# Altium schematic sheet Analog_Frontend_OpAmp.SchDoc
size A4; CompanyName: Technische Hochschule Nürnberg Georg Simon Ohm; Organization: UltraZohm; Address1: Kesslerplatz 12; Address2: 90489 Nürnberg; Address3: GERMANY; DocumentNumber: 5; SheetNumber: 5; SheetTotal: 12; Website: www.ultrazohm.com
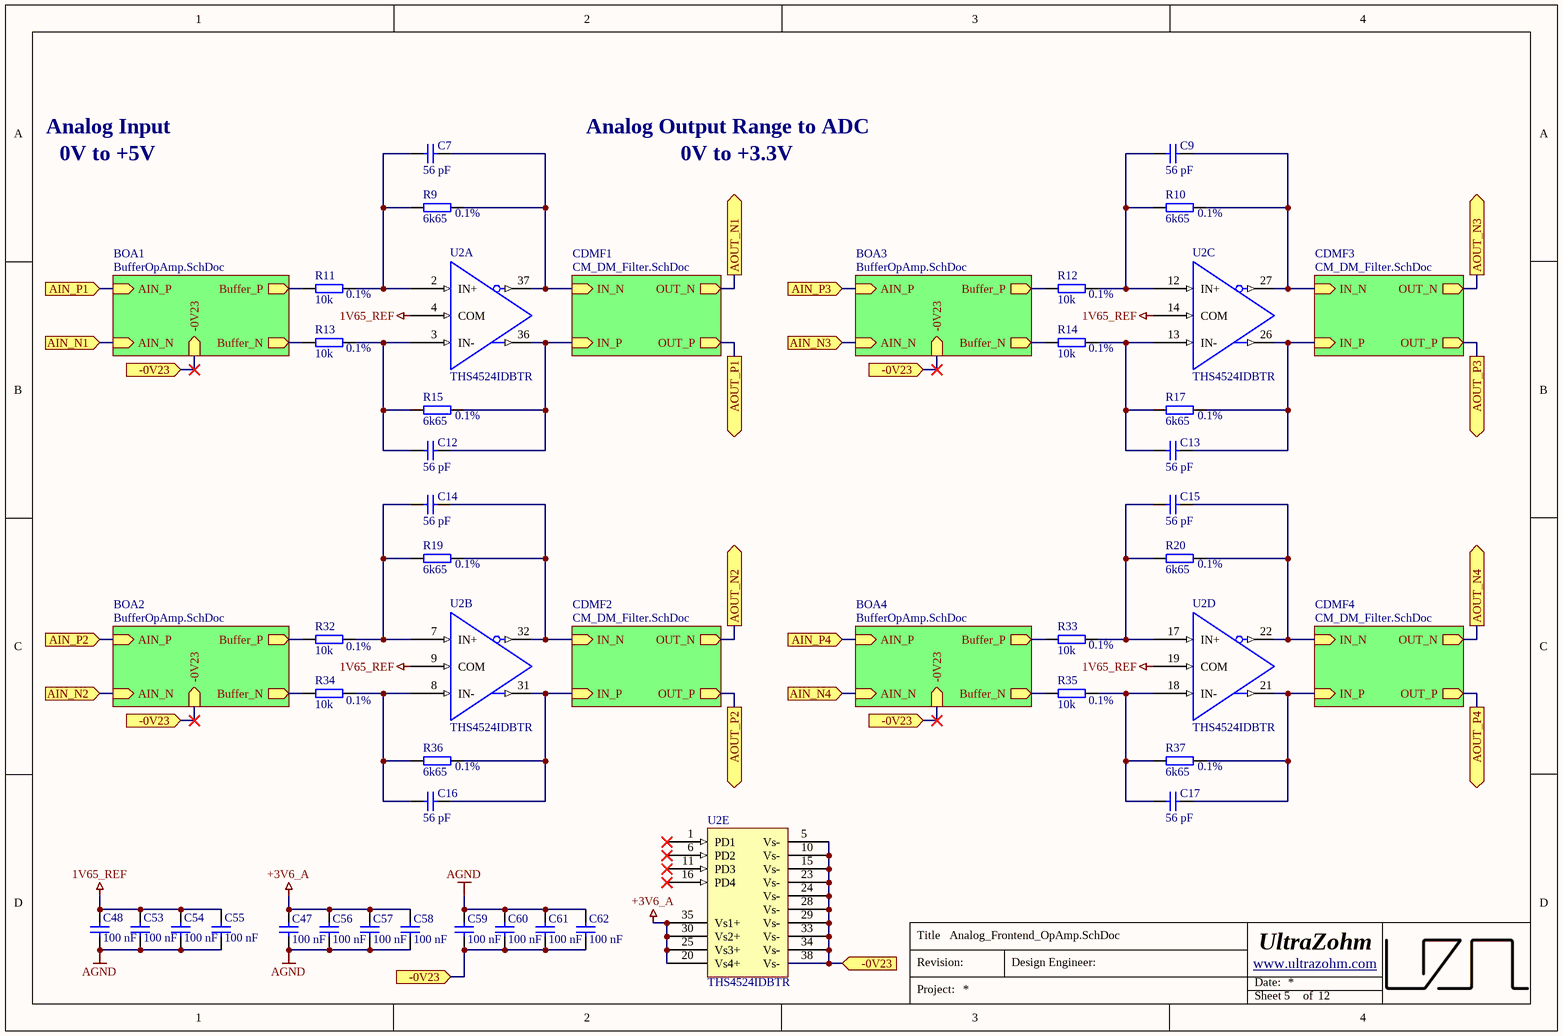
[diagram p0: Analog_Frontend_OpAmp.SchDoc]

## Parts
C7  56 pF  [C_0402_TE]
C9  56 pF  [C_0402_TE]
C12  56 pF  [C_0402_TE]
C13  56 pF  [C_0402_TE]
C14  56 pF  [C_0402_TE]
C15  56 pF  [C_0402_TE]
C16  56 pF  [C_0402_TE]
C17  56 pF  [C_0402_TE]
C47  100 nF  [C_0402_TE]
C48  100 nF  [C_0402_TE]
C53  100 nF  [C_0402_TE]
C54  100 nF  [C_0402_TE]
C55  100 nF  [C_0402_TE]
C56  100 nF  [C_0402_TE]
C57  100 nF  [C_0402_TE]
C58  100 nF  [C_0402_TE]
C59  100 nF  [C_0402_TE]
C60  100 nF  [C_0402_TE]
C61  100 nF  [C_0402_TE]
C62  100 nF  [C_0402_TE]
R9  6k65  Tolerance: 0.1%  [R_0402_TE]
R10  6k65  Tolerance: 0.1%  [R_0402_TE]
R11  10k  Tolerance: 0.1%  [R_0402_TE]
R12  10k  Tolerance: 0.1%  [R_0402_TE]
R13  10k  Tolerance: 0.1%  [R_0402_TE]
R14  10k  Tolerance: 0.1%  [R_0402_TE]
R15  6k65  Tolerance: 0.1%  [R_0402_TE]
R17  6k65  Tolerance: 0.1%  [R_0402_TE]
R19  6k65  Tolerance: 0.1%  [R_0402_TE]
R20  6k65  Tolerance: 0.1%  [R_0402_TE]
R32  10k  Tolerance: 0.1%  [R_0402_TE]
R33  10k  Tolerance: 0.1%  [R_0402_TE]
R34  10k  Tolerance: 0.1%  [R_0402_TE]
R35  10k  Tolerance: 0.1%  [R_0402_TE]
R36  6k65  Tolerance: 0.1%  [R_0402_TE]
R37  6k65  Tolerance: 0.1%  [R_0402_TE]
U2  THS4524IDBTR  [TSSOP-38]  (parts A,B,C,D,E of 5)

## Sub-sheets
BOA1 = BufferOpAmp.SchDoc: Buffer_P (out), Buffer_N (out), AIN_P (in), AIN_N (in), -0V23 (in)
BOA2 = BufferOpAmp.SchDoc: Buffer_P (out), Buffer_N (out), AIN_P (in), AIN_N (in), -0V23 (in)
BOA3 = BufferOpAmp.SchDoc: Buffer_P (out), Buffer_N (out), AIN_P (in), AIN_N (in), -0V23 (in)
BOA4 = BufferOpAmp.SchDoc: Buffer_P (out), Buffer_N (out), AIN_P (in), AIN_N (in), -0V23 (in)
CDMF1 = CM_DM_Filter.SchDoc: IN_P (in), IN_N (in), OUT_P (out), OUT_N (out)
CDMF2 = CM_DM_Filter.SchDoc: IN_P (in), IN_N (in), OUT_P (out), OUT_N (out)
CDMF3 = CM_DM_Filter.SchDoc: IN_P (in), IN_N (in), OUT_P (out), OUT_N (out)
CDMF4 = CM_DM_Filter.SchDoc: IN_P (in), IN_N (in), OUT_P (out), OUT_N (out)

## Ports
-0V23 (in), AIN_N1 (in), AIN_N2 (in), AIN_N3 (in), AIN_N4 (in), AIN_P1 (in), AIN_P2 (in), AIN_P3 (in), AIN_P4 (in), AOUT_N1 (out), AOUT_N2 (out), AOUT_N3 (out), AOUT_N4 (out), AOUT_P1 (out), AOUT_P2 (out), AOUT_P3 (out), AOUT_P4 (out)

## Nets
1V65_REF: C48.1 C53.1 C54.1 C55.1 U2.4(COM) U2.9(COM) U2.14(COM) U2.19(COM)
+3V6_A: C47.1 C56.1 C57.1 C58.1 U2.20(Vs4+) U2.25(Vs3+) U2.30(Vs2+) U2.35(Vs1+)
AGND: C47.2 C48.2 C53.2 C54.2 C55.2 C56.2 C57.2 C58.2 C59.1 C60.1 C61.1 C62.1
-0V23: C59.2 C60.2 C61.2 C62.2 U2.5(Vs-) U2.10(Vs-) U2.15(Vs-) U2.23(Vs-) U2.24(Vs-) U2.28(Vs-) U2.29(Vs-) U2.33(Vs-) U2.34(Vs-) U2.38(Vs-) ; port -0V23, sheet BOA1/-0V23, sheet BOA2/-0V23, sheet BOA3/-0V23, sheet BOA4/-0V23
AIN_N1: port AIN_N1, sheet BOA1/AIN_N
AIN_N2: port AIN_N2, sheet BOA2/AIN_N
AIN_N3: port AIN_N3, sheet BOA3/AIN_N
AIN_N4: port AIN_N4, sheet BOA4/AIN_N
AIN_P1: port AIN_P1, sheet BOA1/AIN_P
AIN_P2: port AIN_P2, sheet BOA2/AIN_P
AIN_P3: port AIN_P3, sheet BOA3/AIN_P
AIN_P4: port AIN_P4, sheet BOA4/AIN_P
AOUT_N1: port AOUT_N1, sheet CDMF1/OUT_N
AOUT_N2: port AOUT_N2, sheet CDMF2/OUT_N
AOUT_N3: port AOUT_N3, sheet CDMF3/OUT_N
AOUT_N4: port AOUT_N4, sheet CDMF4/OUT_N
AOUT_P1: port AOUT_P1, sheet CDMF1/OUT_P
AOUT_P2: port AOUT_P2, sheet CDMF2/OUT_P
AOUT_P3: port AOUT_P3, sheet CDMF3/OUT_P
AOUT_P4: port AOUT_P4, sheet CDMF4/OUT_P
NetC7_1: C7.1 R9.2 R11.1 U2.2(IN+)
NetC7_2: C7.2 R9.1 U2.37(OUT-) ; sheet CDMF1/IN_N
NetC9_1: C9.1 R10.2 R12.1 U2.12(IN+)
NetC9_2: C9.2 R10.1 U2.27(OUT-) ; sheet CDMF3/IN_N
NetC12_1: C12.1 R13.1 R15.2 U2.3(IN-)
NetC12_2: C12.2 R15.1 U2.36(OUT+) ; sheet CDMF1/IN_P
NetC13_1: C13.1 R14.1 R17.2 U2.13(IN-)
NetC13_2: C13.2 R17.1 U2.26(OUT+) ; sheet CDMF3/IN_P
NetC14_1: C14.1 R19.2 R32.1 U2.7(IN+)
NetC14_2: C14.2 R19.1 U2.32(OUT-) ; sheet CDMF2/IN_N
NetC15_1: C15.1 R20.2 R33.1 U2.17(IN+)
NetC15_2: C15.2 R20.1 U2.22(OUT-) ; sheet CDMF4/IN_N
NetC16_1: C16.1 R34.1 R36.2 U2.8(IN-)
NetC16_2: C16.2 R36.1 U2.31(OUT+) ; sheet CDMF2/IN_P
NetC17_1: C17.1 R35.1 R37.2 U2.18(IN-)
NetC17_2: C17.2 R37.1 U2.21(OUT+) ; sheet CDMF4/IN_P
NetR11_2: R11.2 ; sheet BOA1/Buffer_P
NetR12_2: R12.2 ; sheet BOA3/Buffer_P
NetR13_2: R13.2 ; sheet BOA1/Buffer_N
NetR14_2: R14.2 ; sheet BOA3/Buffer_N
NetR32_2: R32.2 ; sheet BOA2/Buffer_P
NetR33_2: R33.2 ; sheet BOA4/Buffer_P
NetR34_2: R34.2 ; sheet BOA2/Buffer_N
NetR35_2: R35.2 ; sheet BOA4/Buffer_N

Not connected (* = marked no-connect by the designer): U2 1(PD1)* 6(PD2)* 11(PD3)* 16(PD4)*

## Notes on the sheet
- Analog Input
- 0V to +5V
- Analog Output Range to ADC
- 0V to +3.3V
- Title
- Revision:
- Design Engineer:
- Date:
- Project:
- Sheet
- of

## Library data of the parts
C7 C9 C12-C17 = UZgen_C_0402_56pF_50V_NP0: Generic capacitor; Manufacturer: UZgen; Voltage: 50V; Tolerance: 10 %; Created from: UZgenTool; Manufacturer Part Number: UZgen_C_0402_56pF_50V_NP0; PartID: 5655; Created On: 13.12.2024 11:08:44; Value: 56 pF; Device Package: 0402; Technology: NP0; Mounting Type: SMD; Last Updated: 13.12.2024 11:08:44
C47 C48 C53-C62 = UZgen_C_0402_100nF_50V_X7R: Generic capacitor; Manufacturer: UZgen; Voltage: 50V; Tolerance: 10 %; Created from: UZgenTool; Manufacturer Part Number: UZgen_C_0402_100nF_50V_X7R; PartID: 3431; Created On: 02.08.2024 11:17:51; Value: 100 nF; Device Package: 0402; Technology: X7R; Mounting Type: SMD; Last Updated: 02.08.2024 11:17:51
R9 R10 R15 R17 R19 R20 R36 R37 = RT0402BRD076K65L: 62.5mW Thin Film Resistor ±25ppm/℃ ±0.1% 6.65kΩ 0402 Chip Resistor - Surface Mount ROHS; Manufacturer: YAGEO; Created from: AGeiger; Manufacturer Part Number: RT0402BRD076K65L; PartID: 360; Created On: 18.11.2024 08:40:15; ComponentLink1Description: Datasheet; ComponentLink1URL: https://www.lcsc.com/datasheet/lcsc_datasheet_2304140030_YAGEO-RT0402BRD076K65L_C728562.pdf; Component Type: SMD resistor; Device Package: 0402; Last Updated: 18.11.2024 08:40:15; Mounting Type: SMD; Supplier 1: LCSC; Supplier Part Number 1: C728562; Type: Resistor; Value: 6k65; Live Cycle Status: 1; LCSC Part Number: C728562
R11-R14 R32-R35 = RT0402BRD0710KL: 62.5mW Thin Film Resistor 50V ±25ppm/℃ ±0.1% 10kΩ 0402 Chip Resistor - Surface Mount ROHS; Manufacturer: YAGEO; Created from: AGeiger; Manufacturer Part Number: RT0402BRD0710KL; PartID: 359; Created On: 18.11.2024 08:40:15; ComponentLink1Description: Datasheet; ComponentLink1URL: https://www.lcsc.com/datasheet/lcsc_datasheet_2304140030_YAGEO-RT0402BRD0710KL_C190095.pdf; Component Type: SMD resistor; Device Package: 0402; Last Updated: 18.11.2024 08:40:15; Mounting Type: SMD; Supplier 1: LCSC; Supplier Part Number 1: C190095; Type: Resistor; Value: 10k; Live Cycle Status: 1; LCSC Part Number: C190095
U2 = THS4524IDBTR: Differential Amplifier, Very Low Power, Negative Rail Input; Manufacturer: Texas Instruments; Channels: 4; GBP: 145 MHz; CMRR: 80 - 102 dB; Value: Rail-to-Rail; Created from: MGremer; Manufacturer Part Number: THS4524IDBTR; PartID: 2; Created On: 15.01.2021 11:55:32; ComponentLink1Description: Datasheet; ComponentLink1URL: https://www.ti.com/lit/ds/symlink/ths4524.pdf?HQS=dis-mous-null-mousermode-dsf-pf-null-wwe&ts=1610629243115&ref_url=https%253A%252F%252Fwww.mouser.de%252F; Component Type: Differential Amplifier; Device Package: TSSOP-38; Last Updated: 15.11.2024 08:41:37; Mounting Type: SMD; Operating Temperature: -40 to +85 °C; Supplier 1: Mouser; Supplier Part Number 1: 595-THS4524IDBTR; Supplier 2: LCSC; Supplier Part Number 2: C2057434; Type: Differential Amplifiers; Live Cycle Status: 1; LCSC Part Number: C2057434; Stock number: not stored